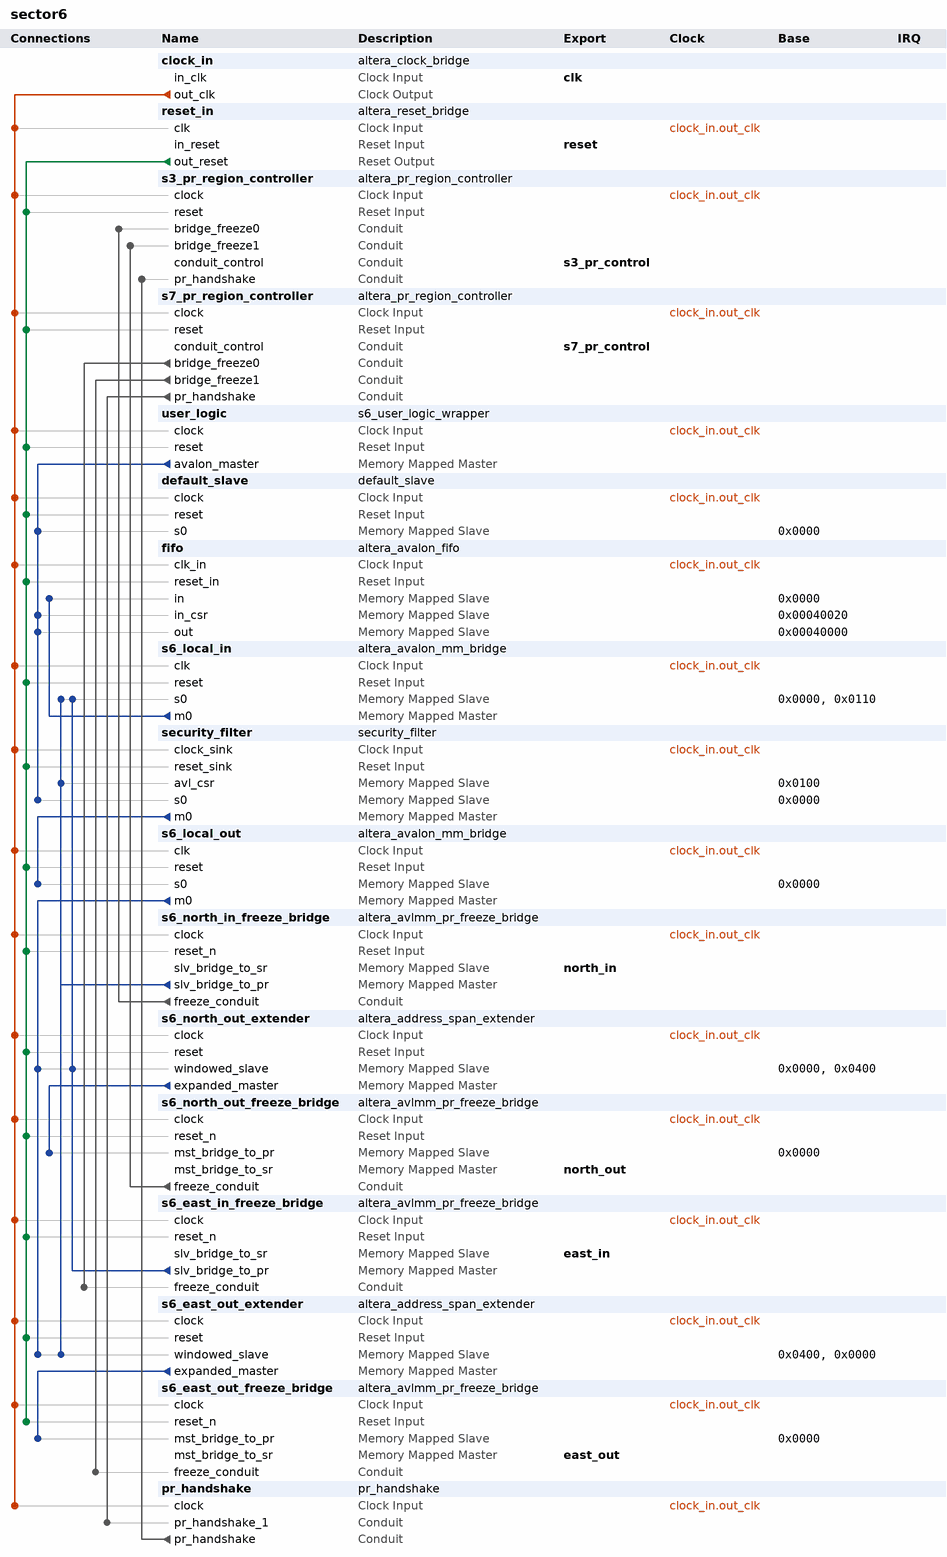
[diagram p0: system contents]
# Platform Designer (Qsys) system sector6, Stratix 10 1SG280HU2F50E2VGS1
# Parameters at their usual value, and those the tool derives, are not listed.
package require -exact qsys 1.0
create_system sector6
set_project_property DEVICE_FAMILY {Stratix 10}
set_project_property DEVICE 1SG280HU2F50E2VGS1

add_component clock_in ip/sector6/sector6_clock_in.ip altera_clock_bridge clock_in 18.0
load_component clock_in
set_component_parameter_value DERIVED_CLOCK_RATE 50000000
set_component_parameter_value EXPLICIT_CLOCK_RATE 50000000
save_component

add_component reset_in ip/sector6/sector6_reset_in.ip altera_reset_bridge reset_in 18.0
load_component reset_in
set_component_parameter_value ACTIVE_LOW_RESET 0
set_component_parameter_value SYNCHRONOUS_EDGES deassert
set_component_parameter_value SYNC_RESET 0
save_component

add_component s3_pr_region_controller ip/sector6/sector6_pr_region_controller_0.ip altera_pr_region_controller s3_pr_region_controller 18.0
load_component s3_pr_region_controller
set_component_parameter_value ENABLE_CSR false
set_component_parameter_value ENABLE_IRQ false
set_component_parameter_value NUM_INTF_BRIDGE 2
set_component_parameter_value ENABLE_PR_REGION_FREEZE false
set_component_parameter_value NUM_PR_REGION_RAM 1
save_component

add_component s7_pr_region_controller ip/sector6/sector6_pr_region_controller_1.ip altera_pr_region_controller s7_pr_region_controller 18.0
load_component s7_pr_region_controller
set_component_parameter_value ENABLE_CSR false
set_component_parameter_value ENABLE_IRQ false
set_component_parameter_value NUM_INTF_BRIDGE 2
set_component_parameter_value ENABLE_PR_REGION_FREEZE false
set_component_parameter_value NUM_PR_REGION_RAM 1
save_component

add_component user_logic ip/sector6/sector6_s6_user_logic_wrapper_0.ip s6_user_logic_wrapper user_logic 1.0

add_component default_slave ip/sector6/sector6_default_slave_0.ip default_slave default_slave 1.0

add_component fifo ip/sector6/sector6_fifo_0.ip altera_avalon_fifo fifo 18.0
load_component fifo
set_component_parameter_value bitsPerSymbol 16
set_component_parameter_value channelWidth 8
set_component_parameter_value errorWidth 8
set_component_parameter_value fifoDepth 16
set_component_parameter_value fifoInputInterfaceOptions AVALONMM_WRITE
set_component_parameter_value fifoOutputInterfaceOptions AVALONMM_READ
set_component_parameter_value singleClockMode true
set_component_parameter_value symbolsPerBeat 2
set_component_parameter_value useIRQ false
set_component_parameter_value usePacket true
set_component_parameter_value useReadControl false
save_component

add_component s6_local_in ip/sector6/s6_local_in.ip altera_avalon_mm_bridge s6_local_in 18.0
load_component s6_local_in
set_component_parameter_value DATA_WIDTH 32
set_component_parameter_value ADDRESS_WIDTH 4
set_component_parameter_value USE_AUTO_ADDRESS_WIDTH 0
set_component_parameter_value ADDRESS_UNITS SYMBOLS
set_component_parameter_value MAX_PENDING_RESPONSES 4
set_component_parameter_value SYNC_RESET 0
save_component

add_component security_filter ip/sector6/sector6_security_filter_0.ip security_filter security_filter 0
load_component security_filter
set_component_parameter_value DROP_ADDR 255
set_component_parameter_value S0_ADDR 256
set_component_parameter_value S1_ADDR 128
set_component_parameter_value S2_ADDR 0
set_component_parameter_value S3_ADDR 768
set_component_parameter_value S4_ADDR 672
set_component_parameter_value S5_ADDR 528
set_component_parameter_value S6_ADDR 255
set_component_parameter_value S7_ADDR 1168
set_component_parameter_value S8_ADDR 1024
set_component_parameter_value DATA_SIZE 32
set_component_parameter_value AVMM_ADDR_SIZE 16
save_component

add_component s6_local_out ip/sector6/s6_local_out.ip altera_avalon_mm_bridge s6_local_out 18.0
load_component s6_local_out
set_component_parameter_value DATA_WIDTH 32
set_component_parameter_value ADDRESS_WIDTH 16
set_component_parameter_value USE_AUTO_ADDRESS_WIDTH 0
set_component_parameter_value ADDRESS_UNITS SYMBOLS
set_component_parameter_value MAX_PENDING_RESPONSES 4
set_component_parameter_value SYNC_RESET 0
save_component

add_component s6_north_in_freeze_bridge ip/sector6/s6_north_in_freeze_bridge.ip altera_avlmm_pr_freeze_bridge s6_north_in_freeze_bridge 18.0
load_component s6_north_in_freeze_bridge
set_component_parameter_value Interface_Type {Avalon-MM Slave}
set_component_parameter_value ENABLE_FREEZE_FROM_PR_REGION false
set_component_parameter_value ENABLE_TRAFFIC_TRACKING false
set_component_parameter_value slv_bridge_signal_name_DERIVED address,beginbursttransfer,byteenable,debugaccess,read,write,readdata,writedata,waitrequest,readdatavalid,burstcount,response,lock,writeresponsevalid
set_component_parameter_value slv_bridge_signal_Enable Yes,No,Yes,No,Yes,Yes,Yes,Yes,Yes,Yes,No,No,No,No
set_component_parameter_value SLV_BRIDGE_ADDR_WIDTH 20
set_component_parameter_value SLV_BRIDGE_SYMBOL_WIDTH 8
set_component_parameter_value SLV_BRIDGE_BYTEEN_WIDTH 4
set_component_parameter_value SLV_BRIDGE_BURSTCOUNT_WIDTH 3
set_component_parameter_value SLV_BRIDGE_BURST_LINEWRAP false
set_component_parameter_value SLV_BRIDGE_CONSTANTBURSTBEHAVIOR false
set_component_parameter_value SLV_BRIDGE_BURST_BNDR_ONLY false
set_component_parameter_value SLV_BRIDGE_MAX_PENDING_READS 1
set_component_parameter_value SLV_BRIDGE_MAX_PENDING_WRITES 0
set_component_parameter_value SLV_BRIDGE_FIX_READ_LATENCY 0
set_component_parameter_value SLV_BRIDGE_READ_WAIT_TIME 1
set_component_parameter_value SLV_BRIDGE_WRITE_WAIT_TIME 0
set_component_parameter_value SLV_BRIDGE_ADDRESS_UNITS SYMBOLS
set_component_parameter_value mst_bridge_signal_name_DERIVED address,beginbursttransfer,byteenable,debugaccess,read,write,readdata,writedata,waitrequest,readdatavalid,burstcount,response,lock,writeresponsevalid
set_component_parameter_value mst_bridge_signal_Enable Yes,Yes,Yes,Yes,Yes,Yes,Yes,Yes,Yes,Yes,Yes,Yes,Yes,Yes
set_component_parameter_value MST_BRIDGE_ADDR_WIDTH 32
set_component_parameter_value MST_BRIDGE_SYMBOL_WIDTH 8
set_component_parameter_value MST_BRIDGE_BYTEEN_WIDTH 4
set_component_parameter_value MST_BRIDGE_BURSTCOUNT_WIDTH 3
set_component_parameter_value MST_BRIDGE_BURST_LINEWRAP true
set_component_parameter_value MST_BRIDGE_BURST_BNDR_ONLY true
set_component_parameter_value MST_BRIDGE_CONSTANTBURSTBEHAVIOR true
set_component_parameter_value MST_BRIDGE_MAX_PENDING_READS 1
set_component_parameter_value MST_BRIDGE_MAX_PENDING_WRITES 1
set_component_parameter_value MST_BRIDGE_FIX_READ_LATENCY 0
set_component_parameter_value MST_BRIDGE_READ_WAIT_TIME 1
set_component_parameter_value MST_BRIDGE_WRITE_WAIT_TIME 0
set_component_parameter_value MST_BRIDGE_ADDRESS_UNITS SYMBOLS
save_component

add_component s6_north_out_extender ip/sector6/s6_north_out_extender.ip altera_address_span_extender s6_north_out_extender 18.0
load_component s6_north_out_extender
set_component_parameter_value DATA_WIDTH 32
set_component_parameter_value MASTER_ADDRESS_WIDTH 20
set_component_parameter_value SLAVE_ADDRESS_WIDTH 8
set_component_parameter_value BURSTCOUNT_WIDTH 1
set_component_parameter_value MASTER_ADDRESS_DEF 0
set_component_parameter_value ENABLE_SLAVE_PORT false
set_component_parameter_value MAX_PENDING_READS 4
set_component_parameter_value SYNC_RESET 0
save_component

add_component s6_north_out_freeze_bridge ip/sector6/s6_north_out_freeze_bridge.ip altera_avlmm_pr_freeze_bridge s6_north_out_freeze_bridge 18.0
load_component s6_north_out_freeze_bridge
set_component_parameter_value Interface_Type {Avalon-MM Master}
set_component_parameter_value ENABLE_FREEZE_FROM_PR_REGION false
set_component_parameter_value ENABLE_TRAFFIC_TRACKING false
set_component_parameter_value slv_bridge_signal_name_DERIVED address,beginbursttransfer,byteenable,debugaccess,read,write,readdata,writedata,waitrequest,readdatavalid,burstcount,response,lock,writeresponsevalid
set_component_parameter_value slv_bridge_signal_Enable Yes,Yes,Yes,Yes,Yes,Yes,Yes,Yes,Yes,Yes,Yes,Yes,Yes,Yes
set_component_parameter_value SLV_BRIDGE_ADDR_WIDTH 32
set_component_parameter_value SLV_BRIDGE_SYMBOL_WIDTH 8
set_component_parameter_value SLV_BRIDGE_BYTEEN_WIDTH 4
set_component_parameter_value SLV_BRIDGE_BURSTCOUNT_WIDTH 3
set_component_parameter_value SLV_BRIDGE_BURST_LINEWRAP true
set_component_parameter_value SLV_BRIDGE_CONSTANTBURSTBEHAVIOR true
set_component_parameter_value SLV_BRIDGE_BURST_BNDR_ONLY true
set_component_parameter_value SLV_BRIDGE_MAX_PENDING_READS 1
set_component_parameter_value SLV_BRIDGE_MAX_PENDING_WRITES 1
set_component_parameter_value SLV_BRIDGE_FIX_READ_LATENCY 0
set_component_parameter_value SLV_BRIDGE_READ_WAIT_TIME 1
set_component_parameter_value SLV_BRIDGE_WRITE_WAIT_TIME 0
set_component_parameter_value SLV_BRIDGE_ADDRESS_UNITS SYMBOLS
set_component_parameter_value mst_bridge_signal_name_DERIVED address,beginbursttransfer,byteenable,debugaccess,read,write,readdata,writedata,waitrequest,readdatavalid,burstcount,response,lock,writeresponsevalid
set_component_parameter_value mst_bridge_signal_Enable Yes,No,Yes,No,Yes,Yes,Yes,Yes,Yes,Yes,No,No,No,No
set_component_parameter_value MST_BRIDGE_ADDR_WIDTH 20
set_component_parameter_value MST_BRIDGE_SYMBOL_WIDTH 8
set_component_parameter_value MST_BRIDGE_BYTEEN_WIDTH 4
set_component_parameter_value MST_BRIDGE_BURSTCOUNT_WIDTH 3
set_component_parameter_value MST_BRIDGE_BURST_LINEWRAP false
set_component_parameter_value MST_BRIDGE_BURST_BNDR_ONLY false
set_component_parameter_value MST_BRIDGE_CONSTANTBURSTBEHAVIOR false
set_component_parameter_value MST_BRIDGE_MAX_PENDING_READS 1
set_component_parameter_value MST_BRIDGE_MAX_PENDING_WRITES 0
set_component_parameter_value MST_BRIDGE_FIX_READ_LATENCY 0
set_component_parameter_value MST_BRIDGE_READ_WAIT_TIME 1
set_component_parameter_value MST_BRIDGE_WRITE_WAIT_TIME 0
set_component_parameter_value MST_BRIDGE_ADDRESS_UNITS SYMBOLS
save_component

add_component s6_east_in_freeze_bridge ip/sector6/s6_east_in_freeze_bridge.ip altera_avlmm_pr_freeze_bridge s6_east_in_freeze_bridge 18.0
load_component s6_east_in_freeze_bridge
set_component_parameter_value Interface_Type {Avalon-MM Slave}
set_component_parameter_value ENABLE_FREEZE_FROM_PR_REGION false
set_component_parameter_value ENABLE_TRAFFIC_TRACKING false
set_component_parameter_value slv_bridge_signal_name_DERIVED address,beginbursttransfer,byteenable,debugaccess,read,write,readdata,writedata,waitrequest,readdatavalid,burstcount,response,lock,writeresponsevalid
set_component_parameter_value slv_bridge_signal_Enable Yes,No,Yes,No,Yes,Yes,Yes,Yes,Yes,Yes,No,No,No,No
set_component_parameter_value SLV_BRIDGE_ADDR_WIDTH 20
set_component_parameter_value SLV_BRIDGE_SYMBOL_WIDTH 8
set_component_parameter_value SLV_BRIDGE_BYTEEN_WIDTH 4
set_component_parameter_value SLV_BRIDGE_BURSTCOUNT_WIDTH 3
set_component_parameter_value SLV_BRIDGE_BURST_LINEWRAP false
set_component_parameter_value SLV_BRIDGE_CONSTANTBURSTBEHAVIOR false
set_component_parameter_value SLV_BRIDGE_BURST_BNDR_ONLY false
set_component_parameter_value SLV_BRIDGE_MAX_PENDING_READS 1
set_component_parameter_value SLV_BRIDGE_MAX_PENDING_WRITES 0
set_component_parameter_value SLV_BRIDGE_FIX_READ_LATENCY 0
set_component_parameter_value SLV_BRIDGE_READ_WAIT_TIME 1
set_component_parameter_value SLV_BRIDGE_WRITE_WAIT_TIME 0
set_component_parameter_value SLV_BRIDGE_ADDRESS_UNITS SYMBOLS
set_component_parameter_value mst_bridge_signal_name_DERIVED address,beginbursttransfer,byteenable,debugaccess,read,write,readdata,writedata,waitrequest,readdatavalid,burstcount,response,lock,writeresponsevalid
set_component_parameter_value mst_bridge_signal_Enable Yes,Yes,Yes,Yes,Yes,Yes,Yes,Yes,Yes,Yes,Yes,Yes,Yes,Yes
set_component_parameter_value MST_BRIDGE_ADDR_WIDTH 32
set_component_parameter_value MST_BRIDGE_SYMBOL_WIDTH 8
set_component_parameter_value MST_BRIDGE_BYTEEN_WIDTH 4
set_component_parameter_value MST_BRIDGE_BURSTCOUNT_WIDTH 3
set_component_parameter_value MST_BRIDGE_BURST_LINEWRAP true
set_component_parameter_value MST_BRIDGE_BURST_BNDR_ONLY true
set_component_parameter_value MST_BRIDGE_CONSTANTBURSTBEHAVIOR true
set_component_parameter_value MST_BRIDGE_MAX_PENDING_READS 1
set_component_parameter_value MST_BRIDGE_MAX_PENDING_WRITES 1
set_component_parameter_value MST_BRIDGE_FIX_READ_LATENCY 0
set_component_parameter_value MST_BRIDGE_READ_WAIT_TIME 1
set_component_parameter_value MST_BRIDGE_WRITE_WAIT_TIME 0
set_component_parameter_value MST_BRIDGE_ADDRESS_UNITS SYMBOLS
save_component

add_component s6_east_out_extender ip/sector6/s6_east_out_extender.ip altera_address_span_extender s6_east_out_extender 18.0
load_component s6_east_out_extender
set_component_parameter_value DATA_WIDTH 32
set_component_parameter_value MASTER_ADDRESS_WIDTH 20
set_component_parameter_value SLAVE_ADDRESS_WIDTH 6
set_component_parameter_value BURSTCOUNT_WIDTH 1
set_component_parameter_value MASTER_ADDRESS_DEF 0
set_component_parameter_value ENABLE_SLAVE_PORT false
set_component_parameter_value MAX_PENDING_READS 4
set_component_parameter_value SYNC_RESET 0
save_component

add_component s6_east_out_freeze_bridge ip/sector6/s6_east_out_freeze_bridge.ip altera_avlmm_pr_freeze_bridge s6_east_out_freeze_bridge 18.0
load_component s6_east_out_freeze_bridge
set_component_parameter_value Interface_Type {Avalon-MM Master}
set_component_parameter_value ENABLE_FREEZE_FROM_PR_REGION false
set_component_parameter_value ENABLE_TRAFFIC_TRACKING false
set_component_parameter_value slv_bridge_signal_name_DERIVED address,beginbursttransfer,byteenable,debugaccess,read,write,readdata,writedata,waitrequest,readdatavalid,burstcount,response,lock,writeresponsevalid
set_component_parameter_value slv_bridge_signal_Enable Yes,Yes,Yes,Yes,Yes,Yes,Yes,Yes,Yes,Yes,Yes,Yes,Yes,Yes
set_component_parameter_value SLV_BRIDGE_ADDR_WIDTH 32
set_component_parameter_value SLV_BRIDGE_SYMBOL_WIDTH 8
set_component_parameter_value SLV_BRIDGE_BYTEEN_WIDTH 4
set_component_parameter_value SLV_BRIDGE_BURSTCOUNT_WIDTH 3
set_component_parameter_value SLV_BRIDGE_BURST_LINEWRAP true
set_component_parameter_value SLV_BRIDGE_CONSTANTBURSTBEHAVIOR true
set_component_parameter_value SLV_BRIDGE_BURST_BNDR_ONLY true
set_component_parameter_value SLV_BRIDGE_MAX_PENDING_READS 1
set_component_parameter_value SLV_BRIDGE_MAX_PENDING_WRITES 1
set_component_parameter_value SLV_BRIDGE_FIX_READ_LATENCY 0
set_component_parameter_value SLV_BRIDGE_READ_WAIT_TIME 1
set_component_parameter_value SLV_BRIDGE_WRITE_WAIT_TIME 0
set_component_parameter_value SLV_BRIDGE_ADDRESS_UNITS SYMBOLS
set_component_parameter_value mst_bridge_signal_name_DERIVED address,beginbursttransfer,byteenable,debugaccess,read,write,readdata,writedata,waitrequest,readdatavalid,burstcount,response,lock,writeresponsevalid
set_component_parameter_value mst_bridge_signal_Enable Yes,No,Yes,No,Yes,Yes,Yes,Yes,Yes,Yes,No,No,No,No
set_component_parameter_value MST_BRIDGE_ADDR_WIDTH 20
set_component_parameter_value MST_BRIDGE_SYMBOL_WIDTH 8
set_component_parameter_value MST_BRIDGE_BYTEEN_WIDTH 4
set_component_parameter_value MST_BRIDGE_BURSTCOUNT_WIDTH 3
set_component_parameter_value MST_BRIDGE_BURST_LINEWRAP false
set_component_parameter_value MST_BRIDGE_BURST_BNDR_ONLY false
set_component_parameter_value MST_BRIDGE_CONSTANTBURSTBEHAVIOR false
set_component_parameter_value MST_BRIDGE_MAX_PENDING_READS 1
set_component_parameter_value MST_BRIDGE_MAX_PENDING_WRITES 0
set_component_parameter_value MST_BRIDGE_FIX_READ_LATENCY 0
set_component_parameter_value MST_BRIDGE_READ_WAIT_TIME 1
set_component_parameter_value MST_BRIDGE_WRITE_WAIT_TIME 0
set_component_parameter_value MST_BRIDGE_ADDRESS_UNITS SYMBOLS
save_component

add_component pr_handshake ip/sector6/sector6_pr_handshake_0.ip pr_handshake pr_handshake 1.0

# connections
add_connection clock_in.out_clk default_slave.clock clock
add_connection clock_in.out_clk fifo.clk_in clock
add_connection clock_in.out_clk pr_handshake.clock clock
add_connection clock_in.out_clk reset_in.clk clock
add_connection clock_in.out_clk s3_pr_region_controller.clock clock
add_connection clock_in.out_clk s6_east_in_freeze_bridge.clock clock
add_connection clock_in.out_clk s6_east_out_extender.clock clock
add_connection clock_in.out_clk s6_east_out_freeze_bridge.clock clock
add_connection clock_in.out_clk s6_local_in.clk clock
add_connection clock_in.out_clk s6_local_out.clk clock
add_connection clock_in.out_clk s6_north_in_freeze_bridge.clock clock
add_connection clock_in.out_clk s6_north_out_extender.clock clock
add_connection clock_in.out_clk s6_north_out_freeze_bridge.clock clock
add_connection clock_in.out_clk s7_pr_region_controller.clock clock
add_connection clock_in.out_clk security_filter.clock_sink clock
add_connection clock_in.out_clk user_logic.clock clock
add_connection reset_in.out_reset default_slave.reset reset
add_connection reset_in.out_reset fifo.reset_in reset
add_connection reset_in.out_reset s3_pr_region_controller.reset reset
add_connection reset_in.out_reset s6_east_in_freeze_bridge.reset_n reset
add_connection reset_in.out_reset s6_east_out_extender.reset reset
add_connection reset_in.out_reset s6_east_out_freeze_bridge.reset_n reset
add_connection reset_in.out_reset s6_local_in.reset reset
add_connection reset_in.out_reset s6_local_out.reset reset
add_connection reset_in.out_reset s6_north_in_freeze_bridge.reset_n reset
add_connection reset_in.out_reset s6_north_out_extender.reset reset
add_connection reset_in.out_reset s6_north_out_freeze_bridge.reset_n reset
add_connection reset_in.out_reset s7_pr_region_controller.reset reset
add_connection reset_in.out_reset security_filter.reset_sink reset
add_connection reset_in.out_reset user_logic.reset reset
add_connection s6_east_in_freeze_bridge.slv_bridge_to_pr s6_local_in.s0 avalon
set_connection_parameter_value s6_east_in_freeze_bridge.slv_bridge_to_pr/s6_local_in.s0 baseAddress 0x0000
add_connection s6_east_in_freeze_bridge.slv_bridge_to_pr s6_north_out_extender.windowed_slave avalon
set_connection_parameter_value s6_east_in_freeze_bridge.slv_bridge_to_pr/s6_north_out_extender.windowed_slave baseAddress 0x0400
add_connection s6_east_out_extender.expanded_master s6_east_out_freeze_bridge.mst_bridge_to_pr avalon
set_connection_parameter_value s6_east_out_extender.expanded_master/s6_east_out_freeze_bridge.mst_bridge_to_pr baseAddress 0x0000
add_connection s6_local_in.m0 fifo.in avalon
set_connection_parameter_value s6_local_in.m0/fifo.in baseAddress 0x0000
add_connection s6_local_out.m0 s6_east_out_extender.windowed_slave avalon
set_connection_parameter_value s6_local_out.m0/s6_east_out_extender.windowed_slave baseAddress 0x0400
add_connection s6_local_out.m0 s6_north_out_extender.windowed_slave avalon
set_connection_parameter_value s6_local_out.m0/s6_north_out_extender.windowed_slave baseAddress 0x0000
add_connection s6_north_in_freeze_bridge.slv_bridge_to_pr s6_east_out_extender.windowed_slave avalon
set_connection_parameter_value s6_north_in_freeze_bridge.slv_bridge_to_pr/s6_east_out_extender.windowed_slave baseAddress 0x0000
add_connection s6_north_in_freeze_bridge.slv_bridge_to_pr s6_local_in.s0 avalon
set_connection_parameter_value s6_north_in_freeze_bridge.slv_bridge_to_pr/s6_local_in.s0 baseAddress 0x0110
add_connection s6_north_in_freeze_bridge.slv_bridge_to_pr security_filter.avl_csr avalon
set_connection_parameter_value s6_north_in_freeze_bridge.slv_bridge_to_pr/security_filter.avl_csr baseAddress 0x0100
add_connection s6_north_out_extender.expanded_master s6_north_out_freeze_bridge.mst_bridge_to_pr avalon
set_connection_parameter_value s6_north_out_extender.expanded_master/s6_north_out_freeze_bridge.mst_bridge_to_pr baseAddress 0x0000
add_connection security_filter.m0 s6_local_out.s0 avalon
set_connection_parameter_value security_filter.m0/s6_local_out.s0 baseAddress 0x0000
add_connection user_logic.avalon_master default_slave.s0 avalon
set_connection_parameter_value user_logic.avalon_master/default_slave.s0 baseAddress 0x0000
set_connection_parameter_value user_logic.avalon_master/default_slave.s0 defaultConnection true
add_connection user_logic.avalon_master fifo.in_csr avalon
set_connection_parameter_value user_logic.avalon_master/fifo.in_csr baseAddress 0x00040020
add_connection user_logic.avalon_master fifo.out avalon
set_connection_parameter_value user_logic.avalon_master/fifo.out baseAddress 0x00040000
add_connection user_logic.avalon_master security_filter.s0 avalon
set_connection_parameter_value user_logic.avalon_master/security_filter.s0 baseAddress 0x0000
add_connection pr_handshake.pr_handshake s3_pr_region_controller.pr_handshake conduit
add_connection s6_north_in_freeze_bridge.freeze_conduit s3_pr_region_controller.bridge_freeze0 conduit
add_connection s6_north_out_freeze_bridge.freeze_conduit s3_pr_region_controller.bridge_freeze1 conduit
add_connection s7_pr_region_controller.bridge_freeze0 s6_east_in_freeze_bridge.freeze_conduit conduit
add_connection s7_pr_region_controller.bridge_freeze1 s6_east_out_freeze_bridge.freeze_conduit conduit
add_connection s7_pr_region_controller.pr_handshake pr_handshake.pr_handshake_1 conduit

# exported interfaces
add_interface clk clock sink
set_interface_property clk EXPORT_OF clock_in.in_clk
add_interface east_in avalon slave
set_interface_property east_in EXPORT_OF s6_east_in_freeze_bridge.slv_bridge_to_sr
add_interface east_out avalon master
set_interface_property east_out EXPORT_OF s6_east_out_freeze_bridge.mst_bridge_to_sr
add_interface north_in avalon slave
set_interface_property north_in EXPORT_OF s6_north_in_freeze_bridge.slv_bridge_to_sr
add_interface north_out avalon master
set_interface_property north_out EXPORT_OF s6_north_out_freeze_bridge.mst_bridge_to_sr
add_interface reset reset sink
set_interface_property reset EXPORT_OF reset_in.in_reset
add_interface s3_pr_control conduit end
set_interface_property s3_pr_control EXPORT_OF s3_pr_region_controller.conduit_control
add_interface s7_pr_control conduit end
set_interface_property s7_pr_control EXPORT_OF s7_pr_region_controller.conduit_control

set_interconnect_requirement {$system} qsys_mm.clockCrossingAdapter HANDSHAKE
set_interconnect_requirement {$system} qsys_mm.enableEccProtection FALSE
set_interconnect_requirement {$system} qsys_mm.insertDefaultSlave FALSE
set_interconnect_requirement {$system} qsys_mm.maxAdditionalLatency 4

save_system sector6.qsys
